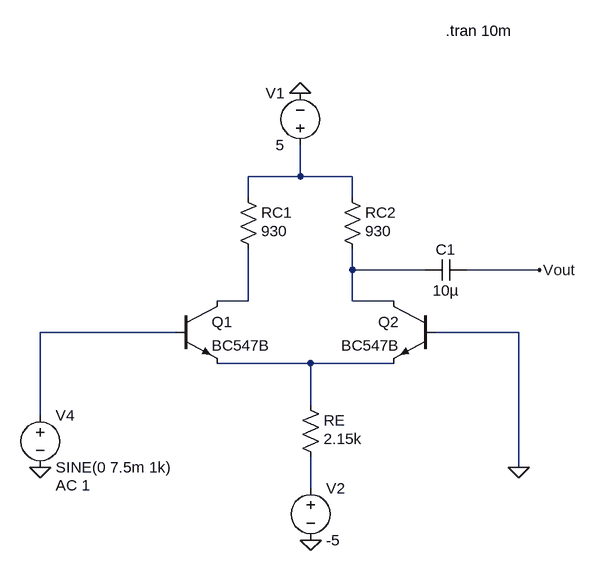
[diagram p0: schematic pre_amp_stage.asc]
pre_amp_stage.asc, the LTspice schematic file:
Version 4
SHEET 1 1368 680
WIRE 208 48 208 0
WIRE 208 48 128 48
WIRE 288 48 208 48
WIRE 128 80 128 48
WIRE 288 80 288 48
WIRE 288 192 288 160
WIRE 400 192 288 192
WIRE 576 192 464 192
WIRE 128 240 128 160
WIRE 128 240 80 240
WIRE 288 240 288 192
WIRE 352 240 288 240
WIRE 16 288 -192 288
WIRE 544 288 416 288
WIRE 224 336 80 336
WIRE 352 336 224 336
WIRE 224 400 224 336
WIRE -192 416 -192 288
WIRE 544 496 544 288
WIRE 224 528 224 480
FLAG 208 -80 0
FLAG 224 608 0
FLAG -192 496 0
FLAG 544 496 0
FLAG 576 192 Vout
SYMBOL res 272 64 R0
WINDOW 3 36 68 Left 2
SYMATTR Value 930
SYMATTR InstName RC2
SYMBOL res 112 64 R0
WINDOW 3 36 68 Left 2
SYMATTR Value 930
SYMATTR InstName RC1
SYMBOL voltage 208 16 R180
WINDOW 0 24 96 Left 2
WINDOW 3 24 16 Left 2
WINDOW 123 0 0 Left 0
WINDOW 39 0 0 Left 0
SYMATTR InstName V1
SYMATTR Value 5
SYMBOL res 208 384 R0
WINDOW 3 36 68 Left 2
SYMATTR Value 2.15k
SYMATTR InstName RE
SYMBOL voltage 224 512 R0
WINDOW 123 0 0 Left 0
WINDOW 39 0 0 Left 0
SYMATTR InstName V2
SYMATTR Value -5
SYMBOL npn 16 240 R0
SYMATTR InstName Q1
SYMATTR Value BC547B
SYMBOL npn 416 240 M0
SYMATTR InstName Q2
SYMATTR Value BC547B
SYMBOL voltage -192 400 R0
WINDOW 123 24 124 Left 2
WINDOW 39 0 0 Left 0
SYMATTR Value2 AC 1
SYMATTR InstName V4
SYMATTR Value SINE(0 7.5m 1k)
SYMBOL cap 464 176 R90
WINDOW 0 0 32 VBottom 2
WINDOW 3 32 32 VTop 2
SYMATTR InstName C1
SYMATTR Value 10µ
TEXT 432 -176 Left 2 !.tran 10m

The netlist it stands for:
* pre_amp_stage.asc
RC2 N001 N002 930
RC1 N001 N003 930
V1 N001 0 5
RE N005 N006 2.15k
V2 N006 0 -5
Q1 N003 N004 N005 0 BC547B
Q2 N002 0 N005 0 BC547B
V4 N004 0 SINE(0 7.5m 1k) AC 1
C1 Vout N002 10µ
.model NPN NPN
.model PNP PNP
.lib standard.bjt
.tran 10m
.backanno
.end